# EAGLE design singleBlinkCricut (EAGLE 9.6.2)
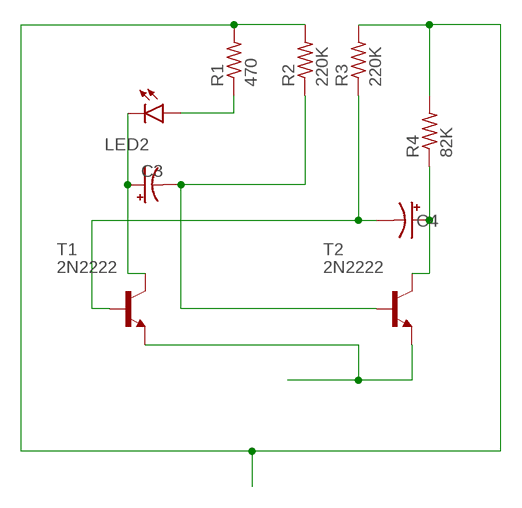
[diagram p0: schematic, sheet 1]

## Parts
C3  CPOL-USE2.5-6  [E2,5-6]
C4  CPOL-USE2.5-6  [E2,5-6]
LED2  LED10MM  [LED10MM]
R1  470  R-US_0411/12  [0411/12]
R2  220K  R-US_0411/12  [0411/12]
R3  220K  R-US_0411/12  [0411/12]
R4  82K  R-US_0411/12  [0411/12]
T1  2N2222  [TO92-EBC-OVAL]
T2  2N2222  [TO92-EBC-OVAL]

## Nets
3V: R1.2 R2.2 R3.2 R4.2
GND: T1.E T2.E
N$1: C3.- R2.1 T2.B
N$2: C3.+ LED2.K(C) T1.C
N$3: LED2.A R1.1
N$5: C4.- R3.1 T1.B
N$6: C4.+ R4.1 T2.C

## Library data of the parts
C3 C4 = adafruit:CPOL-US: POLARIZED CAPACITOR, American symbol
LED2 = led:LED: LED OSRAM: - CHIPLED LG R971, LG N971, LY N971, LG Q971, LY Q971, LO R971, LY R971 LH N974, LH R974 LS Q976, LO Q976, LY Q976 LO Q996 - Hyper CHIPLED LW Q18S LB Q993, LB Q99A, LB R99A - SideLED LS A670, LO A670, LY A670, LG A670, LP A670 LB A673, LV A673, LT A673, LW A673 LH A674 LY A675 LS A676, LA A676, LO A676, LY A676, LW A676 LS A679, LY A679, LG A679 - Hyper Micro SIDELED® LS Y876, LA Y876, LO Y876, LY Y876 LT Y87S - SmartLED LW L88C, LW L88S LB L89C, LB L89S, LG L890 LS L89K, LO L89K, LY L89K LS L896, LA L896, LO L896, LY L896 - TOPLED LS T670, LO T670, LY T670, LG T670, LP T670 LSG T670, LSP T670, LSY T670, LOP T670, LYG T670 LG T671, LOG T671, LSG T671 LB T673, LV T673, LT T673, LW T673 LH T674 LS T676, LA T676, LO T676, LY T676, LB T676, LH T676, LSB T676, LW T676 LB T67C, LV T67C, LT T67C, LS T67K, LO T67K, LY T67K, LW E67C LS E67B, LA E67B, LO E67B, LY E67B, LB E67C, LV E67C, LT E67C LW T67C LS T679, LY T679, LG T679 LS T770, LO T770, LY T770, LG T770, LP T770 LB T773, LV T773, LT T773, LW T773 LH T774 LS E675, LA E675, LY E675, LS T675 LS T776, LA T776, LO T776, LY T776, LB T776 LHGB T686 LT T68C, LB T68C - Hyper Mini TOPLED® LB M676 - Mini TOPLED Santana® LG M470 LS M47K, LO M47K, LY M47K Source: http://www.osram.convergy.de LUXEON: - LUMILED® LXK2-PW12-R00, LXK2-PW12-S00, LXK2-PW14-U00, LXK2-PW14-V00 LXK2-PM12-R00, LXK2-PM12-S00, LXK2-PM14-U00 LXK2-PE12-Q00, LXK2-PE12-R00, LXK2-PE12-S00, LXK2-PE14-T00, LXK2-PE14-U00 LXK2-PB12-K00, LXK2-PB12-L00, LXK2-PB12-M00, LXK2-PB14-N00, LXK2-PB14-P00, LXK2-PB14-Q00 LXK2-PR12-L00, LXK2-PR12-M00, LXK2-PR14-Q00, LXK2-PR14-R00 LXK2-PD12-Q00, LXK2-PD12-R00, LXK2-PD12-S00 LXK2-PH12-R00, LXK2-PH12-S00 LXK2-PL12-P00, LXK2-PL12-Q00, LXK2-PL12-R00 Source: www.luxeon.com KINGBRIGHT: KA-3528ASYC Source: www.kingbright.com
R1-R4 = adafruit:R-US_: RESISTOR, American symbol
T1 T2 = adafruit:2N2222: NPN TRANSISTOR Big oval pads

## Board
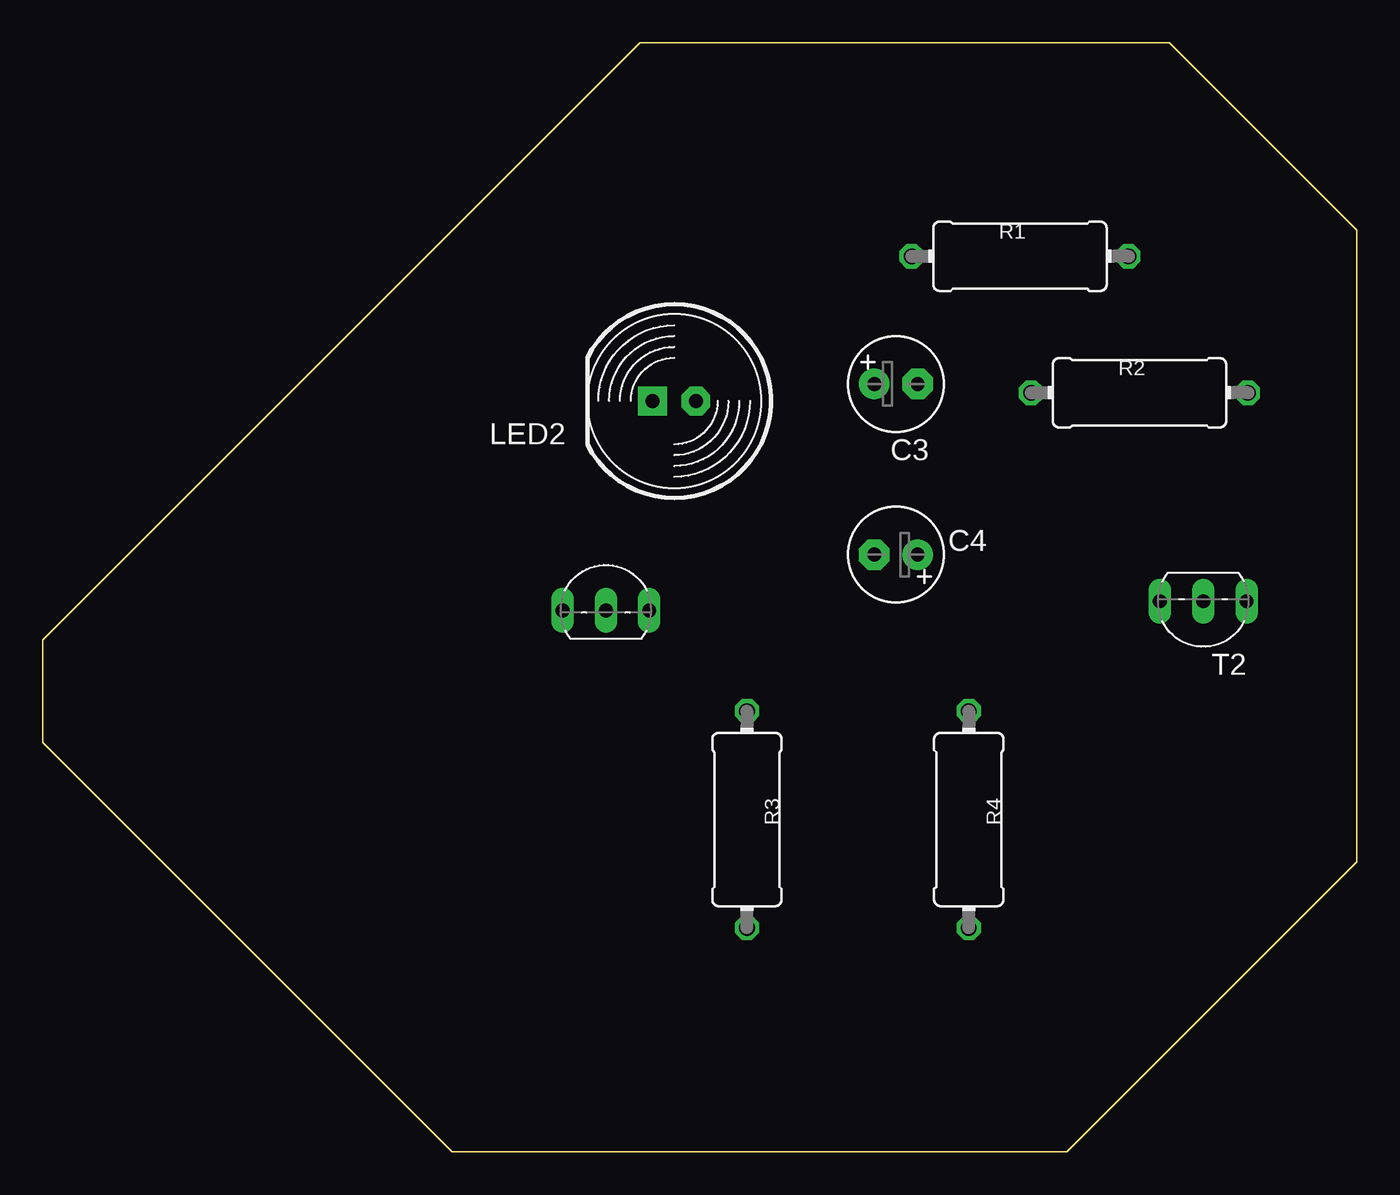
[diagram p1: board, top side]
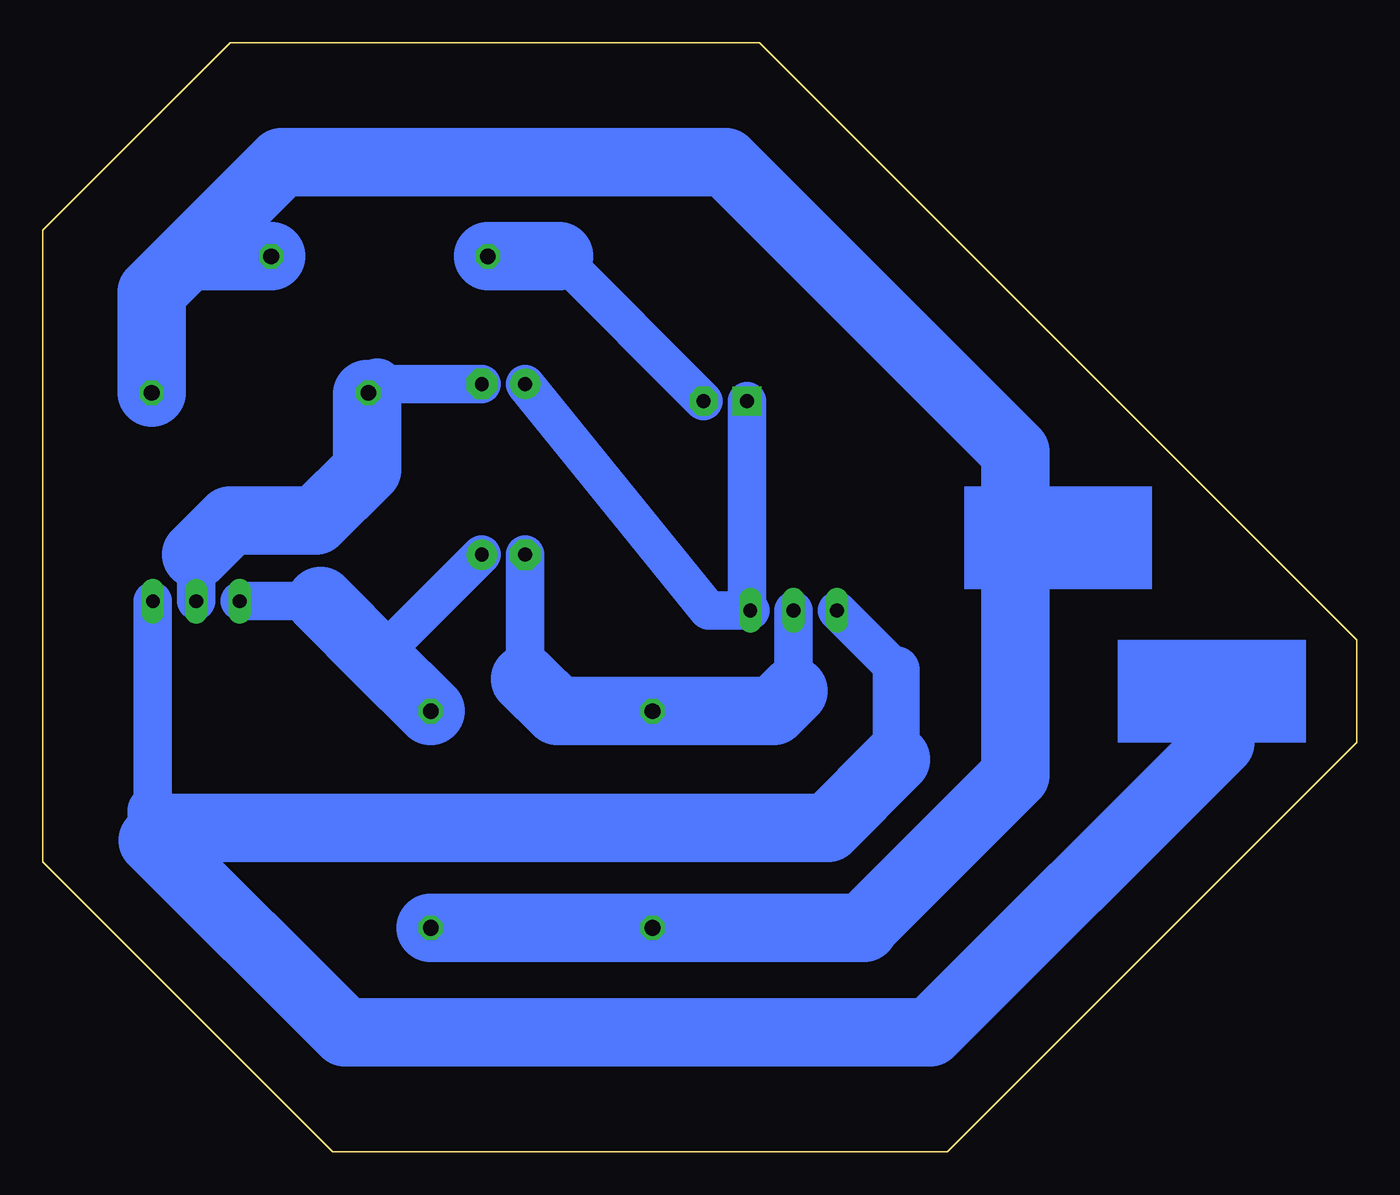
[diagram p2: board, bottom side, seen from below]

Size 77 x 65 mm. Coordinates in mm from the lower left corner, seen from the top.
Outline: 35,65 0,30 0,24 24,0 60,0 77,17 77,54 66,65 35,65
Copper layers (1*16): Top 0.035mm / dielectric 1.5mm / Bottom 0.035mm
Design rules "default": minimum track width 6mil, minimum drill 0.35mm, track to track 6mil, track to pad 6mil, pad to pad 6mil, via to via 6mil, smd to smd 6mil, copper to edge 40mil, drill to drill 6mil, minimum pad ring 10mil, minimum via ring 8mil, stop-mask expansion 4mil, vias tented up to drill 0mil, thermal gap 10mil

### Footprints (pad centres in the part's own frame; a part is rotated, then mirrored left to right if it is on the bottom)
E2,5-6 = drill 0.813 pad 1.778: + -1.27,0 | drill 0.813 pad 1.778 octagon: - 1.27,0
LED10MM = drill 0.813 pad 1.676 octagon: A -1.27,0 | drill 0.813 pad 1.676 square: K 1.27,0
0411/12 = drill 0.914 octagon: 1 -6.35,0; 2 6.35,0
TO92-EBC-OVAL = drill 0.813 long: B 0,-1.27; C 2.54,-1.27; E -2.54,-1.27

### Placement (x,y rotation side)
C3  50,45 0 top
C4  50,35 180 top
LED2  37,44 180 top
R1  57.26,52.48 0 top
R2  64.26,44.48 0 top
R3  41.26,19.48 270 top
R4  54.26,19.48 270 top
T1  33,33 0 top
T2  68,31 180 top

### Tracks (layer width: path | path; a pad name or v marks a point on that pad's centre or on a via)
3V
  Bottom 1.27: 37.23,58 38,58 | 28.87,13.22 28.87,13.13
  Bottom 4: R1.2 68.52,52.48 | R2.2 70.61,50.39 68.52,52.48 | 68.52,52.48 63,58 38,58 37,58 20,41 20,22.09 28.87,13.22 | R4.2 R3.2 28.87,13.13
GND
  Bottom 1.27: 69.54,19 70.54,20
  Bottom 2.25: T2.E 70.54,20 | T1.E 27,28.27
  Bottom 2.75: 27,28.27 27,23
  Bottom 3: 70.54,20 70.54,18.27
  Bottom 4: 70.54,18.27 59.27,7 25,7 8,24 8,27 | 27,23 31,19 69.54,19
N$1
  Bottom 1.27: R2.1 58,44.4
  Bottom 2.25: C3.- 57.4,45 | T2.B 68,35
  Bottom 3: 57.4,45 R2.1
  Bottom 4: 58,44.4 58,40 61,37 66,37 68,35
N$2
  Bottom 2.25: C3.+ 38,31.73 T1.C 35.73,31.92 LED2.K
N$3
  Bottom 2.25: 46.75,52.48 LED2.A
  Bottom 4: R1.1 46.75,52.48
N$5
  Bottom 2.25: T1.B 33,27 | C4.- 48.73,27.73
  Bottom 4: 33,27 34.17,25.83 R3.1 46.83,25.83 48.73,27.73
N$6
  Bottom 1.27: 57.22,29.05 57.22,28.78
  Bottom 2.25: 60.7,32.27 T2.C | C4.+ 57.22,29.05
  Bottom 4: R4.1 57.22,28.78 60.7,32.27
(copper drawn outside any net)
  shapes: Bottom area x2